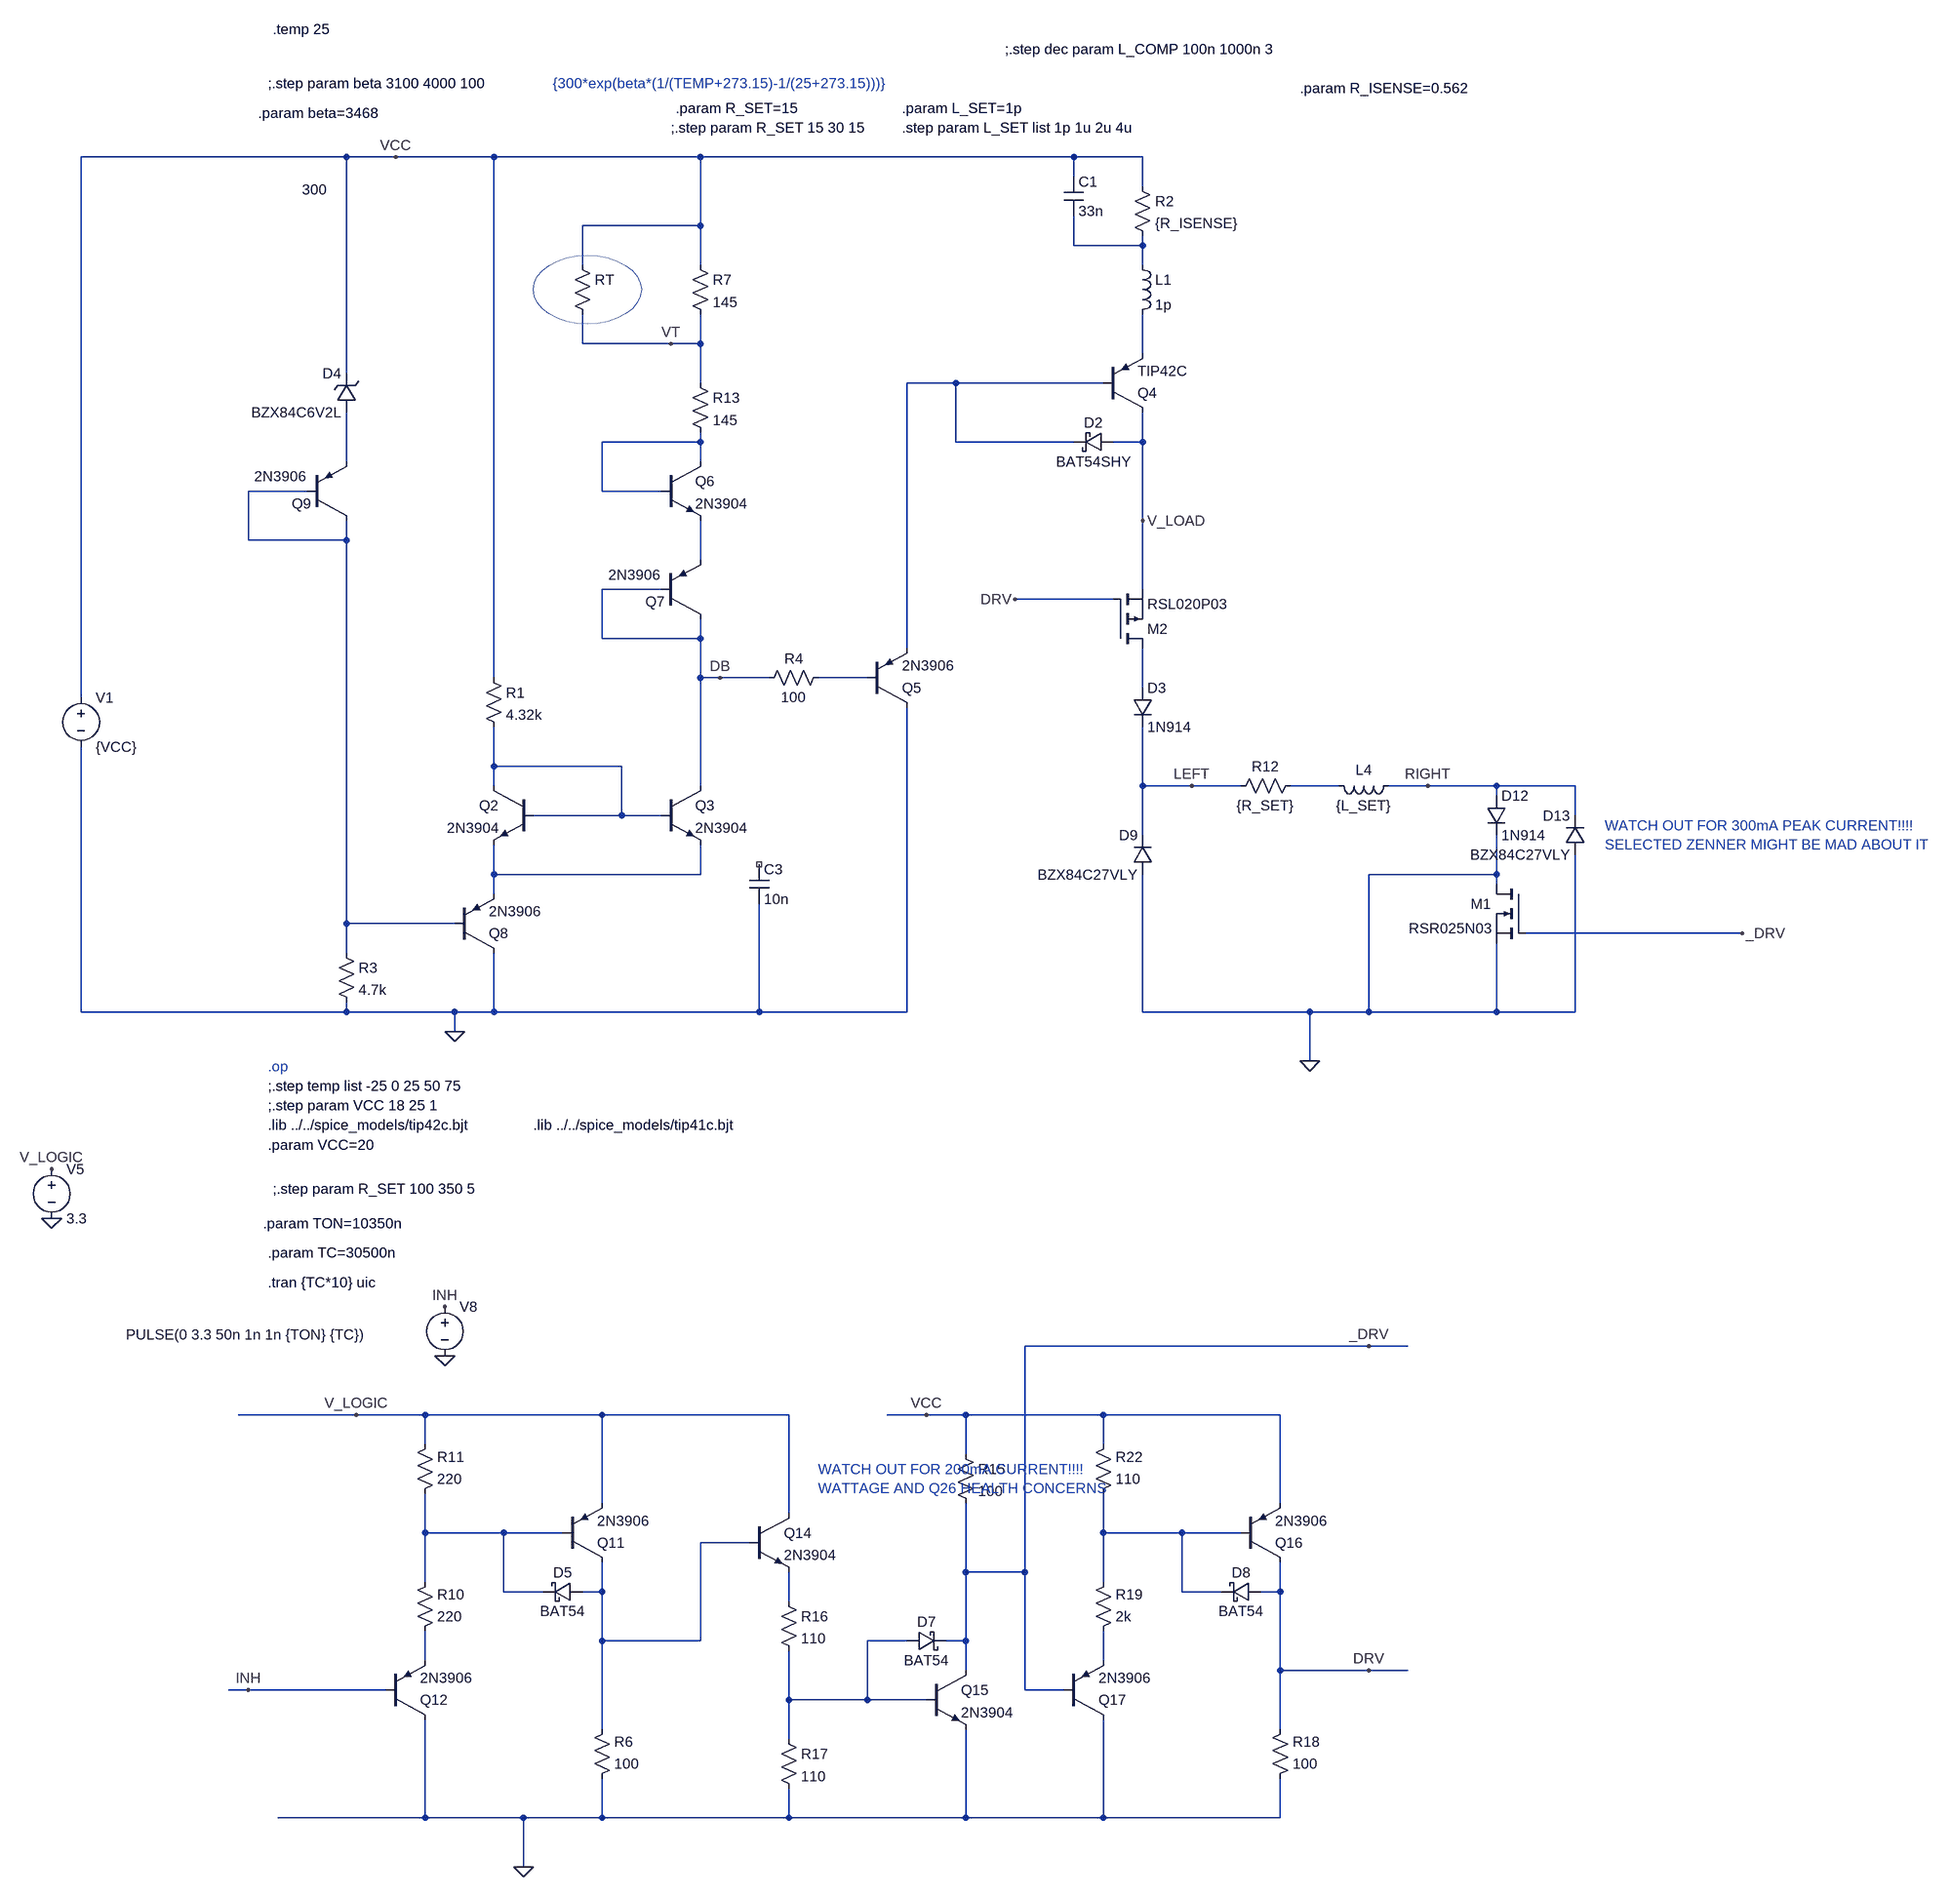
[diagram p0: schematic sense_inhibit2.asc]
sense_inhibit2.asc, the LTspice schematic file:
Version 4
SHEET 1 4220 5156
WIRE -2496 -1376 -2928 -1376
WIRE -2416 -1376 -2496 -1376
WIRE -2256 -1376 -2416 -1376
WIRE -1920 -1376 -2256 -1376
WIRE -1312 -1376 -1920 -1376
WIRE -1200 -1376 -1312 -1376
WIRE -1312 -1344 -1312 -1376
WIRE -1200 -1328 -1200 -1376
WIRE -1920 -1264 -1920 -1376
WIRE -1920 -1264 -2112 -1264
WIRE -1312 -1232 -1312 -1280
WIRE -1200 -1232 -1200 -1248
WIRE -1200 -1232 -1312 -1232
WIRE -2112 -1200 -2112 -1264
WIRE -1920 -1200 -1920 -1264
WIRE -1200 -1200 -1200 -1232
WIRE -2112 -1072 -2112 -1120
WIRE -1968 -1072 -2112 -1072
WIRE -1920 -1072 -1920 -1120
WIRE -1920 -1072 -1968 -1072
WIRE -1200 -1056 -1200 -1120
WIRE -2496 -1024 -2496 -1376
WIRE -1920 -1008 -1920 -1072
WIRE -1504 -1008 -1584 -1008
WIRE -1264 -1008 -1504 -1008
WIRE -1920 -912 -1920 -928
WIRE -1920 -912 -2080 -912
WIRE -1504 -912 -1504 -1008
WIRE -1312 -912 -1504 -912
WIRE -1200 -912 -1200 -960
WIRE -1200 -912 -1248 -912
WIRE -2496 -880 -2496 -960
WIRE -1920 -880 -1920 -912
WIRE -2560 -832 -2656 -832
WIRE -2080 -832 -2080 -912
WIRE -1984 -832 -2080 -832
WIRE -1200 -784 -1200 -912
WIRE -2656 -752 -2656 -832
WIRE -2496 -752 -2496 -784
WIRE -2496 -752 -2656 -752
WIRE -1920 -720 -1920 -784
WIRE -1984 -672 -2080 -672
WIRE -1200 -672 -1200 -784
WIRE -1248 -656 -1408 -656
WIRE -2080 -592 -2080 -672
WIRE -1920 -592 -1920 -624
WIRE -1920 -592 -2080 -592
WIRE -1584 -576 -1584 -1008
WIRE -2256 -528 -2256 -1376
WIRE -1920 -528 -1920 -592
WIRE -1888 -528 -1920 -528
WIRE -1808 -528 -1888 -528
WIRE -1648 -528 -1728 -528
WIRE -1200 -512 -1200 -576
WIRE -2928 -496 -2928 -1376
WIRE -2256 -384 -2256 -448
WIRE -2048 -384 -2256 -384
WIRE -2256 -352 -2256 -384
WIRE -1920 -352 -1920 -528
WIRE -1200 -352 -1200 -448
WIRE -1120 -352 -1200 -352
WIRE -1040 -352 -1120 -352
WIRE -880 -352 -960 -352
WIRE -736 -352 -800 -352
WIRE -624 -352 -736 -352
WIRE -496 -352 -624 -352
WIRE -624 -336 -624 -352
WIRE -2048 -304 -2048 -384
WIRE -2048 -304 -2192 -304
WIRE -1984 -304 -2048 -304
WIRE -496 -304 -496 -352
WIRE -1200 -272 -1200 -352
WIRE -2256 -208 -2256 -256
WIRE -1920 -208 -1920 -256
WIRE -1920 -208 -2256 -208
WIRE -624 -208 -624 -272
WIRE -624 -208 -832 -208
WIRE -624 -192 -624 -208
WIRE -2256 -176 -2256 -208
WIRE -2496 -128 -2496 -752
WIRE -2320 -128 -2496 -128
WIRE -224 -112 -576 -112
WIRE -2496 -80 -2496 -128
WIRE -2928 16 -2928 -416
WIRE -2496 16 -2496 0
WIRE -2496 16 -2928 16
WIRE -2320 16 -2496 16
WIRE -2256 16 -2256 -80
WIRE -2256 16 -2320 16
WIRE -1824 16 -1824 -160
WIRE -1824 16 -2256 16
WIRE -1584 16 -1584 -480
WIRE -1584 16 -1824 16
WIRE -1200 16 -1200 -208
WIRE -928 16 -1200 16
WIRE -832 16 -832 -208
WIRE -832 16 -928 16
WIRE -624 16 -624 -96
WIRE -624 16 -832 16
WIRE -496 16 -496 -240
WIRE -496 16 -624 16
WIRE -2320 48 -2320 16
WIRE -928 96 -928 16
WIRE -832 560 -1392 560
WIRE -768 560 -832 560
WIRE -2480 672 -2672 672
WIRE -2368 672 -2480 672
WIRE -2080 672 -2368 672
WIRE -1776 672 -2080 672
WIRE -1552 672 -1616 672
WIRE -1488 672 -1552 672
WIRE -1264 672 -1488 672
WIRE -976 672 -1264 672
WIRE -2368 720 -2368 672
WIRE -1264 720 -1264 672
WIRE -1488 736 -1488 672
WIRE -2080 816 -2080 672
WIRE -976 816 -976 672
WIRE -1776 832 -1776 672
WIRE -2368 864 -2368 800
WIRE -2240 864 -2368 864
WIRE -2144 864 -2240 864
WIRE -1264 864 -1264 800
WIRE -1136 864 -1264 864
WIRE -1040 864 -1136 864
WIRE -1840 880 -1920 880
WIRE -1488 928 -1488 816
WIRE -1392 928 -1392 560
WIRE -1392 928 -1488 928
WIRE -2368 944 -2368 864
WIRE -1264 944 -1264 864
WIRE -2240 960 -2240 864
WIRE -2176 960 -2240 960
WIRE -2080 960 -2080 912
WIRE -2080 960 -2112 960
WIRE -1136 960 -1136 864
WIRE -1072 960 -1136 960
WIRE -976 960 -976 912
WIRE -976 960 -1008 960
WIRE -1776 976 -1776 928
WIRE -2080 1040 -2080 960
WIRE -1920 1040 -1920 880
WIRE -1920 1040 -2080 1040
WIRE -1584 1040 -1648 1040
WIRE -1488 1040 -1488 928
WIRE -1488 1040 -1520 1040
WIRE -2368 1072 -2368 1024
WIRE -1264 1072 -1264 1024
WIRE -1488 1088 -1488 1040
WIRE -976 1088 -976 960
WIRE -832 1088 -976 1088
WIRE -768 1088 -832 1088
WIRE -2656 1120 -2688 1120
WIRE -2432 1120 -2656 1120
WIRE -1392 1120 -1392 928
WIRE -1328 1120 -1392 1120
WIRE -1776 1136 -1776 1056
WIRE -1648 1136 -1648 1040
WIRE -1648 1136 -1776 1136
WIRE -1552 1136 -1648 1136
WIRE -2080 1184 -2080 1040
WIRE -976 1184 -976 1088
WIRE -1776 1200 -1776 1136
WIRE -2368 1328 -2368 1168
WIRE -2368 1328 -2608 1328
WIRE -2208 1328 -2368 1328
WIRE -2080 1328 -2080 1264
WIRE -2080 1328 -2208 1328
WIRE -1776 1328 -1776 1280
WIRE -1776 1328 -2080 1328
WIRE -1488 1328 -1488 1184
WIRE -1488 1328 -1776 1328
WIRE -1264 1328 -1264 1168
WIRE -1264 1328 -1488 1328
WIRE -976 1328 -976 1264
WIRE -976 1328 -1264 1328
WIRE -2208 1408 -2208 1328
FLAG -2320 48 0
FLAG -1968 -1072 VT
FLAG -2416 -1376 VCC
FLAG -1888 -528 DB
FLAG -928 96 0
FLAG -2976 352 0
FLAG -2976 272 V_LOGIC
FLAG -2336 496 INH
FLAG -2336 576 0
FLAG -1408 -656 DRV
FLAG -1120 -352 LEFT
FLAG -736 -352 RIGHT
FLAG -1200 -784 V_LOAD
FLAG -2656 1120 INH
FLAG -2480 672 V_LOGIC
FLAG -1552 672 VCC
FLAG -2208 1408 0
FLAG -832 560 _DRV
FLAG -832 1088 DRV
FLAG -224 -112 _DRV
SYMBOL npn -2192 -352 M0
SYMATTR InstName Q2
SYMATTR Value 2N3904
SYMBOL res -2272 -544 R0
SYMATTR InstName R1
SYMATTR Value 4.32k
SYMBOL res -1216 -1344 R0
SYMATTR InstName R2
SYMATTR Value {R_ISENSE}
SYMBOL voltage -2928 -512 R0
SYMATTR InstName V1
SYMATTR Value {VCC}
SYMBOL npn -1984 -352 R0
SYMATTR InstName Q3
SYMATTR Value 2N3904
SYMBOL pnp -1264 -960 M180
SYMATTR InstName Q4
SYMATTR Value TIP42C
SYMBOL pnp -1648 -480 M180
SYMATTR InstName Q5
SYMATTR Value 2N3906
SYMBOL pnp -1984 -624 M180
WINDOW 0 -25 28 Left 2
WINDOW 3 -86 72 Left 2
SYMATTR InstName Q7
SYMATTR Value 2N3906
SYMBOL npn -1984 -880 R0
SYMATTR InstName Q6
SYMATTR Value 2N3904
SYMBOL res -1936 -1216 R0
SYMATTR InstName R7
SYMATTR Value 145
SYMBOL res -1936 -1024 R0
SYMATTR InstName R13
SYMATTR Value 145
SYMBOL res -2128 -1216 R0
WINDOW 3 -440 -107 Left 2
SYMATTR Value 300
SYMATTR InstName RT
SYMBOL schottky -1248 -928 R90
WINDOW 0 0 32 VBottom 2
WINDOW 3 32 32 VTop 2
SYMATTR InstName D2
SYMATTR Value BAT54SHY
SYMATTR Description Diode
SYMATTR Type diode
SYMBOL res -1056 -336 R270
WINDOW 0 32 56 VTop 2
WINDOW 3 0 56 VBottom 2
SYMATTR InstName R12
SYMATTR Value {R_SET}
SYMBOL ind -784 -368 R90
WINDOW 0 5 56 VBottom 2
WINDOW 3 32 56 VTop 2
SYMATTR InstName L4
SYMATTR Value {L_SET}
SYMBOL voltage -2976 256 R0
SYMATTR InstName V5
SYMATTR Value 3.3
SYMBOL voltage -2336 480 R0
WINDOW 123 0 0 Left 0
WINDOW 39 0 0 Left 0
WINDOW 3 -519 61 Left 2
SYMATTR Value PULSE(0 3.3 50n 1n 1n {TON} {TC})
SYMATTR InstName V8
SYMBOL pmos -1248 -576 M180
SYMATTR InstName M2
SYMATTR Value RSL020P03
SYMBOL cap -1328 -1344 R0
SYMATTR InstName C1
SYMATTR Value 33n
SYMBOL diode -1216 -512 R0
SYMATTR InstName D3
SYMATTR Value 1N914
SYMBOL diode -1184 -208 R180
WINDOW 0 24 64 Left 2
WINDOW 3 24 0 Left 2
SYMATTR InstName D9
SYMATTR Value BZX84C27VLY
SYMBOL schottky -2112 976 M270
WINDOW 0 32 32 VTop 2
WINDOW 3 0 32 VBottom 2
SYMATTR InstName D5
SYMATTR Value BAT54
SYMATTR Description Diode
SYMATTR Type diode
SYMBOL res -2096 1280 M180
WINDOW 0 36 76 Left 2
WINDOW 3 36 40 Left 2
SYMATTR InstName R6
SYMATTR Value 100
SYMBOL res -2384 1040 M180
WINDOW 0 36 76 Left 2
WINDOW 3 36 40 Left 2
SYMATTR InstName R10
SYMATTR Value 220
SYMBOL res -2384 816 M180
WINDOW 0 36 76 Left 2
WINDOW 3 36 40 Left 2
SYMATTR InstName R11
SYMATTR Value 220
SYMBOL pnp -2144 912 M180
SYMATTR InstName Q11
SYMATTR Value 2N3906
SYMBOL pnp -2432 1168 M180
SYMATTR InstName Q12
SYMATTR Value 2N3906
SYMBOL schottky -1584 1024 M90
WINDOW 0 0 32 VBottom 2
WINDOW 3 32 32 VTop 2
SYMATTR InstName D7
SYMATTR Value BAT54
SYMATTR Description Diode
SYMATTR Type diode
SYMBOL res -1504 720 R0
SYMATTR InstName R15
SYMATTR Value 100
SYMBOL res -1792 960 R0
SYMATTR InstName R16
SYMATTR Value 110
SYMBOL res -1792 1184 R0
SYMATTR InstName R17
SYMATTR Value 110
SYMBOL npn -1840 832 R0
SYMATTR InstName Q14
SYMATTR Value 2N3904
SYMBOL npn -1552 1088 R0
SYMATTR InstName Q15
SYMATTR Value 2N3904
SYMBOL schottky -1008 976 M270
WINDOW 0 32 32 VTop 2
WINDOW 3 0 32 VBottom 2
SYMATTR InstName D8
SYMATTR Value BAT54
SYMATTR Description Diode
SYMATTR Type diode
SYMBOL res -992 1280 M180
WINDOW 0 36 76 Left 2
WINDOW 3 36 40 Left 2
SYMATTR InstName R18
SYMATTR Value 100
SYMBOL res -1280 1040 M180
WINDOW 0 36 76 Left 2
WINDOW 3 36 40 Left 2
SYMATTR InstName R19
SYMATTR Value 2k
SYMBOL res -1280 816 M180
WINDOW 0 36 76 Left 2
WINDOW 3 36 40 Left 2
SYMATTR InstName R22
SYMATTR Value 110
SYMBOL pnp -1040 912 M180
SYMATTR InstName Q16
SYMATTR Value 2N3906
SYMBOL pnp -1328 1168 M180
SYMATTR InstName Q17
SYMATTR Value 2N3906
SYMBOL nmos -576 -192 M0
SYMATTR InstName M1
SYMATTR Value RSR025N03
SYMBOL diode -640 -336 R0
SYMATTR InstName D12
SYMATTR Value 1N914
SYMBOL diode -480 -240 R180
WINDOW 0 24 64 Left 2
WINDOW 3 24 0 Left 2
SYMATTR InstName D13
SYMATTR Value BZX84C27VLY
SYMBOL ind -1216 -1216 R0
SYMATTR InstName L1
SYMATTR Value 1p
SYMBOL zener -2480 -960 R180
WINDOW 0 24 64 Left 2
WINDOW 3 24 0 Left 2
SYMATTR InstName D4
SYMATTR Value BZX84C6V2L
SYMBOL res -2512 -96 R0
SYMATTR InstName R3
SYMATTR Value 4.7k
SYMBOL pnp -2320 -80 M180
SYMATTR InstName Q8
SYMATTR Value 2N3906
SYMBOL cap -1840 -224 R0
SYMATTR InstName C3
SYMATTR Value 10n
SYMBOL pnp -2560 -784 M180
WINDOW 0 -25 28 Left 2
WINDOW 3 -86 72 Left 2
SYMATTR InstName Q9
SYMATTR Value 2N3906
SYMBOL res -1712 -544 R90
WINDOW 0 0 56 VBottom 2
WINDOW 3 32 56 VTop 2
SYMATTR InstName R4
SYMATTR Value 100
TEXT -2624 456 Left 2 !.tran {TC*10} uic
TEXT -2624 136 Left 2 !;.step temp list -25 0 25 50 75
TEXT -2624 104 Left 2 ;.op
TEXT -2624 168 Left 2 !;.step param VCC 18 25 1
TEXT -2624 200 Left 2 !.lib ../../spice_models/tip42c.bjt
TEXT -2624 232 Left 2 !.param VCC=20
TEXT -2616 304 Left 2 !;.step param R_SET 100 350 5
TEXT -2640 -1448 Left 2 !.param beta=3468
TEXT -2624 -1496 Left 2 !;.step param beta 3100 4000 100
TEXT -2160 -1496 Left 2 ;{300*exp(beta*(1/(TEMP+273.15)-1/(25+273.15)))}
TEXT -1968 -1424 Left 2 !;.step param R_SET 15 30 15
TEXT -2616 -1584 Left 2 !.temp 25
TEXT -1592 -1424 Left 2 !.step param L_SET list 1p 1u 2u 4u
TEXT -2192 200 Left 2 !.lib ../../spice_models/tip41c.bjt
TEXT -1592 -1456 Left 2 !.param L_SET=1p
TEXT -1960 -1456 Left 2 !.param R_SET=15
TEXT -2632 360 Left 2 !.param TON=10350n
TEXT -2624 408 Left 2 !.param TC=30500n
TEXT -944 -1488 Left 2 !.param R_ISENSE=0.562
TEXT -1728 760 Left 2 ;WATCH OUT FOR 200mA CURRENT!!!!\nWATTAGE AND Q26 HEALTH CONCERNS
TEXT -448 -288 Left 2 ;WATCH OUT FOR 300mA PEAK CURRENT!!!!\nSELECTED ZENNER MIGHT BE MAD ABOUT IT
TEXT -1424 -1552 Left 2 !;.step dec param L_COMP 100n 1000n 3
CIRCLE Normal -2016 -1104 -2192 -1216 2

The netlist it stands for:
* sense_inhibit2.asc
Q2 N010 N010 N012 0 2N3904
R1 VCC N010 4.32k
R2 VCC N001 {R_ISENSE}
V1 VCC 0 {VCC}
Q3 DB N010 N012 0 2N3904
Q4 V_LOAD N003 N002 0 TIP42C
Q5 0 N008 N003 0 2N3906
Q7 DB DB N007 0 2N3906
Q6 N004 N004 N007 0 2N3904
R7 VCC VT 145
R13 VT N004 145
RT VCC VT 300
D2 V_LOAD N003 BAT54SHY
R12 LEFT N011 {R_SET}
L4 RIGHT N011 {L_SET}
V5 V_LOGIC 0 3.3
V8 INH 0 PULSE(0 3.3 50n 1n 1n {TON} {TC})
M2 N009 DRV V_LOAD V_LOAD RSL020P03
C1 VCC N001 33n
D3 N009 LEFT 1N914
D9 0 LEFT BZX84C27VLY
D5 N015 N013 BAT54
R6 0 N015 100
R10 N018 N013 220
R11 N013 V_LOGIC 220
Q11 N015 N013 V_LOGIC 0 2N3906
Q12 0 INH N018 0 2N3906
D7 N017 _DRV BAT54
R15 VCC _DRV 100
R16 N016 N017 110
R17 N017 0 110
Q14 V_LOGIC N015 N016 0 2N3904
Q15 _DRV N017 0 0 2N3904
D8 DRV N014 BAT54
R18 0 DRV 100
R19 N019 N014 2k
R22 N014 VCC 110
Q16 DRV N014 VCC 0 2N3906
Q17 0 _DRV N019 0 2N3906
M1 0 _DRV 0 0 RSR025N03
D12 RIGHT 0 1N914
D13 0 RIGHT BZX84C27VLY
L1 N001 N002 1p
D4 N005 VCC BZX84C6V2L
R3 N006 0 4.7k
Q8 0 N006 N012 0 2N3906
C3 NC_01 0 10n
Q9 N006 N006 N005 0 2N3906
R4 N008 DB 100
.model D D
.lib standard.dio
.model NPN NPN
.model PNP PNP
.lib standard.bjt
.model NMOS NMOS
.model PMOS PMOS
.lib standard.mos
.tran {TC*10} uic
;.step temp list -25 0 25 50 75
* .op
;.step param VCC 18 25 1
.lib ../../spice_models/tip42c.bjt
.param VCC=20
;.step param R_SET 100 350 5
.param beta=3468
;.step param beta 3100 4000 100
* {300*exp(beta*(1/(TEMP+273.15)-1/(25+273.15)))}
;.step param R_SET 15 30 15
.temp 25
.step param L_SET list 1p 1u 2u 4u
.lib ../../spice_models/tip41c.bjt
.param L_SET=1p
.param R_SET=15
.param TON=10350n
.param TC=30500n
.param R_ISENSE=0.562
* WATCH OUT FOR 200mA CURRENT!!!!
* WATTAGE AND Q26 HEALTH CONCERNS
* WATCH OUT FOR 300mA PEAK CURRENT!!!!
* SELECTED ZENNER MIGHT BE MAD ABOUT IT
;.step dec param L_COMP 100n 1000n 3
.backanno
.end